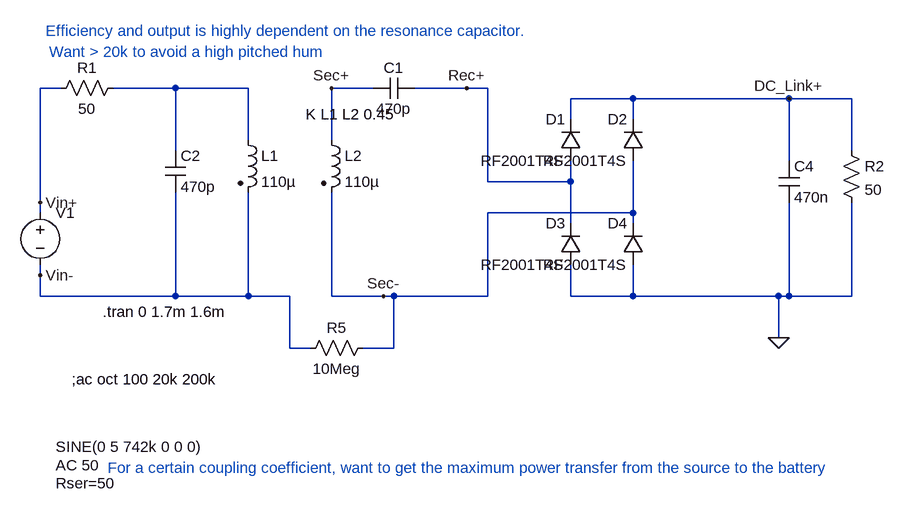
[diagram p0: schematic sig_generator.asc]
sig_generator.asc, the LTspice schematic file:
Version 4
SHEET 1 2420 752
WIRE -1168 112 -1200 112
WIRE -992 112 -1088 112
WIRE -880 112 -992 112
WIRE -688 112 -752 112
WIRE -544 112 -624 112
WIRE -512 112 -544 112
WIRE -288 128 -384 128
WIRE -48 128 -288 128
WIRE 48 128 -48 128
WIRE -384 160 -384 128
WIRE -288 160 -288 128
WIRE -880 192 -880 112
WIRE -752 192 -752 112
WIRE -992 208 -992 112
WIRE 48 208 48 128
WIRE -48 224 -48 128
WIRE -512 256 -512 112
WIRE -384 256 -384 224
WIRE -384 256 -512 256
WIRE -1200 288 -1200 112
WIRE -1200 304 -1200 288
WIRE -288 304 -288 224
WIRE -288 304 -512 304
WIRE -384 320 -384 256
WIRE -288 320 -288 304
WIRE -1200 400 -1200 384
WIRE -1200 432 -1200 400
WIRE -992 432 -992 272
WIRE -992 432 -1200 432
WIRE -880 432 -880 272
WIRE -880 432 -992 432
WIRE -816 432 -880 432
WIRE -752 432 -752 272
WIRE -672 432 -752 432
WIRE -656 432 -672 432
WIRE -512 432 -512 304
WIRE -512 432 -656 432
WIRE -384 432 -384 384
WIRE -288 432 -288 384
WIRE -288 432 -384 432
WIRE -64 432 -288 432
WIRE -48 432 -48 288
WIRE -48 432 -64 432
WIRE 48 432 48 288
WIRE 48 432 -48 432
WIRE -64 496 -64 432
WIRE -816 512 -816 432
WIRE -784 512 -816 512
WIRE -656 512 -656 432
WIRE -656 512 -704 512
FLAG -64 496 0
FLAG -48 128 DC_Link+
FLAG -1200 288 Vin+
FLAG -1200 400 Vin-
FLAG -752 112 Sec+
FLAG -672 432 Sec-
FLAG -544 112 Rec+
SYMBOL ind2 -896 176 R0
SYMATTR InstName L1
SYMATTR Value 110µ
SYMATTR Type ind
SYMATTR SpiceLine Rser=0.6
SYMBOL ind2 -768 176 R0
SYMATTR InstName L2
SYMATTR Value 110µ
SYMATTR Type ind
SYMATTR SpiceLine Rser=0.2
SYMBOL diode -368 384 R180
WINDOW 0 24 64 Left 2
WINDOW 3 24 0 Left 2
SYMATTR InstName D3
SYMATTR Value RF2001T4S
SYMBOL cap -64 224 R0
SYMATTR InstName C4
SYMATTR Value 470n
SYMATTR SpiceLine V=100 Rser=0.1
SYMBOL diode -368 224 R180
WINDOW 0 24 64 Left 2
WINDOW 3 24 0 Left 2
SYMATTR InstName D1
SYMATTR Value RF2001T4S
SYMBOL diode -272 224 R180
WINDOW 0 24 64 Left 2
WINDOW 3 24 0 Left 2
SYMATTR InstName D2
SYMATTR Value RF2001T4S
SYMBOL diode -272 384 R180
WINDOW 0 24 64 Left 2
WINDOW 3 24 0 Left 2
SYMATTR InstName D4
SYMATTR Value RF2001T4S
SYMBOL res -688 496 R90
WINDOW 0 0 56 VBottom 2
WINDOW 3 32 56 VTop 2
SYMATTR InstName R5
SYMATTR Value 10Meg
SYMBOL voltage -1200 288 R0
WINDOW 3 24 376 Left 2
WINDOW 123 24 404 Left 2
WINDOW 39 24 432 Left 2
SYMATTR Value SINE(0 5 742k 0 0 0)
SYMATTR Value2 AC 50
SYMATTR SpiceLine Rser=50
SYMATTR InstName V1
SYMBOL res 32 192 R0
SYMATTR InstName R2
SYMATTR Value 50
SYMBOL cap -1008 208 R0
SYMATTR InstName C2
SYMATTR Value 470p
SYMBOL res -1072 96 R90
WINDOW 0 0 56 VBottom 2
WINDOW 3 32 56 VTop 2
SYMATTR InstName R1
SYMATTR Value 50
SYMBOL cap -624 96 R90
WINDOW 0 0 32 VBottom 2
WINDOW 3 32 32 VTop 2
SYMATTR InstName C1
SYMATTR Value 470p
TEXT -792 152 Left 2 !K L1 L2 0.45
TEXT -1096 696 Left 2 ;For a certain coupling coefficient, want to get the maximum power transfer from the source to the battery
TEXT -760 56 Right 2 ;Want > 20k to avoid a high pitched hum
TEXT -1192 24 Left 2 ;Efficiency and output is highly dependent on the resonance capacitor.
TEXT -1104 456 Left 2 !.tran 0 1.7m 1.6m
TEXT -1152 560 Left 2 !;ac oct 100 20k 200k

The netlist it stands for:
* sig_generator.asc
L1 N001 Vin- 110µ Rser=0.6
L2 Sec+ Sec- 110µ Rser=0.2
D3 0 Rec+ RF2001T4S
C4 DC_Link+ 0 470n V=100 Rser=0.1
D1 Rec+ DC_Link+ RF2001T4S
D2 Sec- DC_Link+ RF2001T4S
D4 0 Sec- RF2001T4S
R5 Sec- Vin- 10Meg
V1 Vin+ Vin- SINE(0 5 742k 0 0 0) AC 50 Rser=50
R2 DC_Link+ 0 50
C2 N001 Vin- 470p
R1 N001 Vin+ 50
C1 Rec+ Sec+ 470p
.model D D
.lib standard.dio
K L1 L2 0.45
* For a certain coupling coefficient, want to get the maximum power transfer from the source to the battery
* Want > 20k to avoid a high pitched hum
* Efficiency and output is highly dependent on the resonance capacitor.
.tran 0 1.7m 1.6m
;ac oct 100 20k 200k
.backanno
.end